# Altium schematic sheet MOSFET.SchDoc
size A
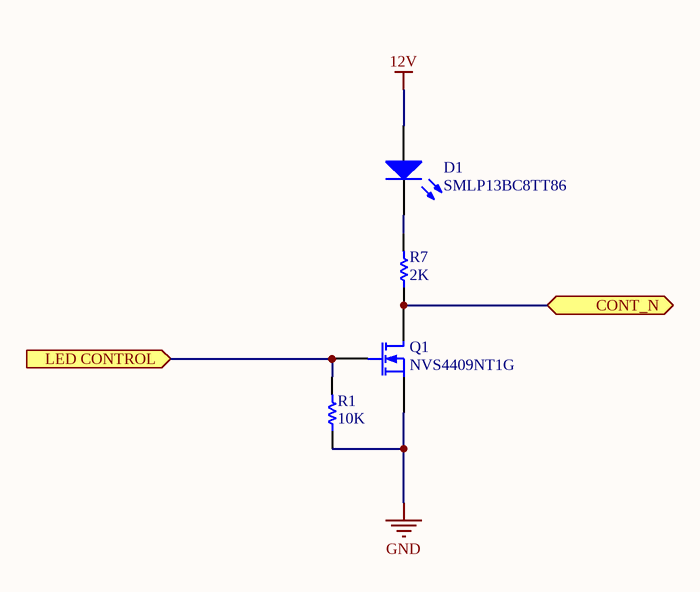
[diagram p0: MOSFET.SchDoc]

## Parts
D1  SMLP13BC8TT86  [SMLP13BC8TT86]
Q1  NVS4409NT1G  [NVS4409NT1G]
R1  value 10K  [J1-0603]  (hidden comment: 5%)
R7  value 2K  [J1-0603]  (hidden comment: 5%)

## Ports
CONT_N (bidir), LED CONTROL (in)

## Nets
12V: D1.1(A)
GND: Q1.3(S) R1.1
CONT_N: Q1.1(D) R7.1 ; port CONT_N
LED CONTROL: Q1.2(G) R1.2 ; port LED CONTROL
NetD1_2: D1.2(K) R7.2

## Library data of the parts
D1 = LED2: Blue 470nm LED Indication - Discrete 2.9V 2-SMD, No Lead; Published: 8-Jun-2000; LatestRevisionDate: 17-Jul-2002; LatestRevisionNote: Re-released for DXP Platform.; PackageVersion: Feb-2002; PackageReference: 3.2X1.6X1.1; Publisher: Altium Limited; PackageDescription: SM LED; 2 Flat Leads
Q1 = MOSFET-N: N-Channel 25V 700mA (Ta) 280mW (Tj) Surface Mount SC-70-3 (SOT323); Published: 8-Jun-2000; LatestRevisionDate: 17-Jul-2002; LatestRevisionNote: Re-released for DXP Platform.; PackageVersion: 1995/1996; PackageReference: E3; Publisher: Altium Limited; PackageDescription: TO, Flat Index; 3 In-Line, Axial Leads; Body Dia. 4.6mm; Lead Dia. 0.5 mm (max)
R1 = Res1: ERJ-3GEYJ103V. 10 kOhms ±5% 0.1W, 1/10W Chip Resistor 0603 (1608 Metric) Automotive AEC-Q200 Thick Film /; Published: 8-Jun-2000; LatestRevisionDate: 17-Jul-2002; LatestRevisionNote: Re-released for DXP Platform.; PackageReference: AXIAL-0.3; Publisher: Altium Limited; PackageDescription: Axial Device, Thru-Hole; 2 Leads; 0.3 in Pin Spacing
R7 = Res1: ERJ-PA3J202V. 2 kOhms ±5% 0.25W, 1/4W Chip Resistor 0603 (1608 Metric) Automotive AEC-Q200, Pulse Withstanding Thick Film /; Published: 8-Jun-2000; LatestRevisionDate: 17-Jul-2002; LatestRevisionNote: Re-released for DXP Platform.; PackageReference: AXIAL-0.3; Publisher: Altium Limited; PackageDescription: Axial Device, Thru-Hole; 2 Leads; 0.3 in Pin Spacing